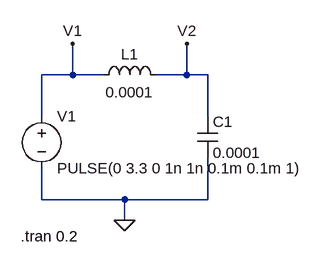
[diagram p0: schematic electronics_lc_tank_2.asc]
electronics_lc_tank_2.asc, the LTspice schematic file:
Version 4
SHEET 1 880 680
WIRE 80 48 80 0
WIRE 80 48 32 48
WIRE 128 48 80 48
WIRE 256 48 256 0
WIRE 256 48 208 48
WIRE 288 48 256 48
WIRE 32 112 32 48
WIRE 288 112 288 48
WIRE 32 240 32 192
WIRE 160 240 32 240
WIRE 288 240 288 176
WIRE 288 240 160 240
WIRE 160 272 160 240
FLAG 80 0 V1
FLAG 256 0 V2
FLAG 160 272 0
SYMBOL voltage 32 96 R0
WINDOW 123 0 0 Left 0
WINDOW 39 0 0 Left 0
SYMATTR InstName V1
SYMATTR Value PULSE(0 3.3 0 1n 1n 0.1m 0.1m 1)
SYMBOL ind 112 64 R270
WINDOW 0 32 56 VTop 2
WINDOW 3 5 56 VBottom 2
SYMATTR InstName L1
SYMATTR Value 0.0001
SYMBOL cap 272 112 R0
SYMATTR InstName C1
SYMATTR Value 0.0001
TEXT 0 296 Left 2 !.tran 0.2

The netlist it stands for:
* electronics_lc_tank_2.asc
V1 V1 0 PULSE(0 3.3 0 1n 1n 0.1m 0.1m 1)
L1 V1 V2 0.0001
C1 V2 0 0.0001
.tran 0.2
.backanno
.end

* Results of the author's LTspice run, read from the files saved beside the schematic
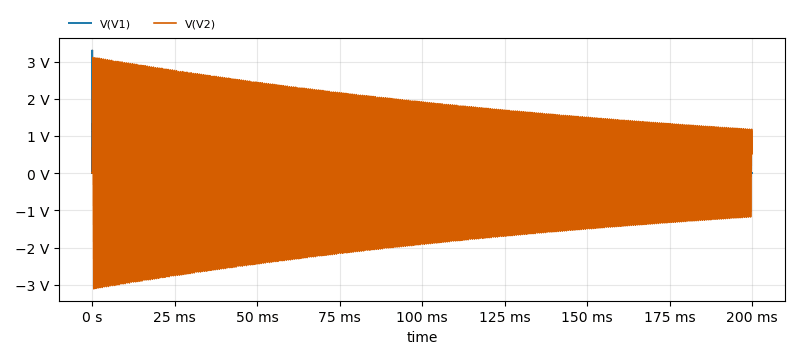
[diagram p1: Transient Analysis of electronics_lc_tank_2.asc, plotted from the saved traces]
* Transient Analysis, 1 run:
*   V(V1): min 0 V, max 3.3 V, average 1.65 mV, rms 73.79 mV, last 0 V
*   V(V2): min -3.11 V, max 3.106 V, average 2.114 mV, rms 1.448 V, last 522.9 mV